# Altium schematic sheet Peripherals.SchDoc: Microcontroller Peripherals
size A3; DocumentNumber: 14; SheetNumber: 14; SheetTotal: 20
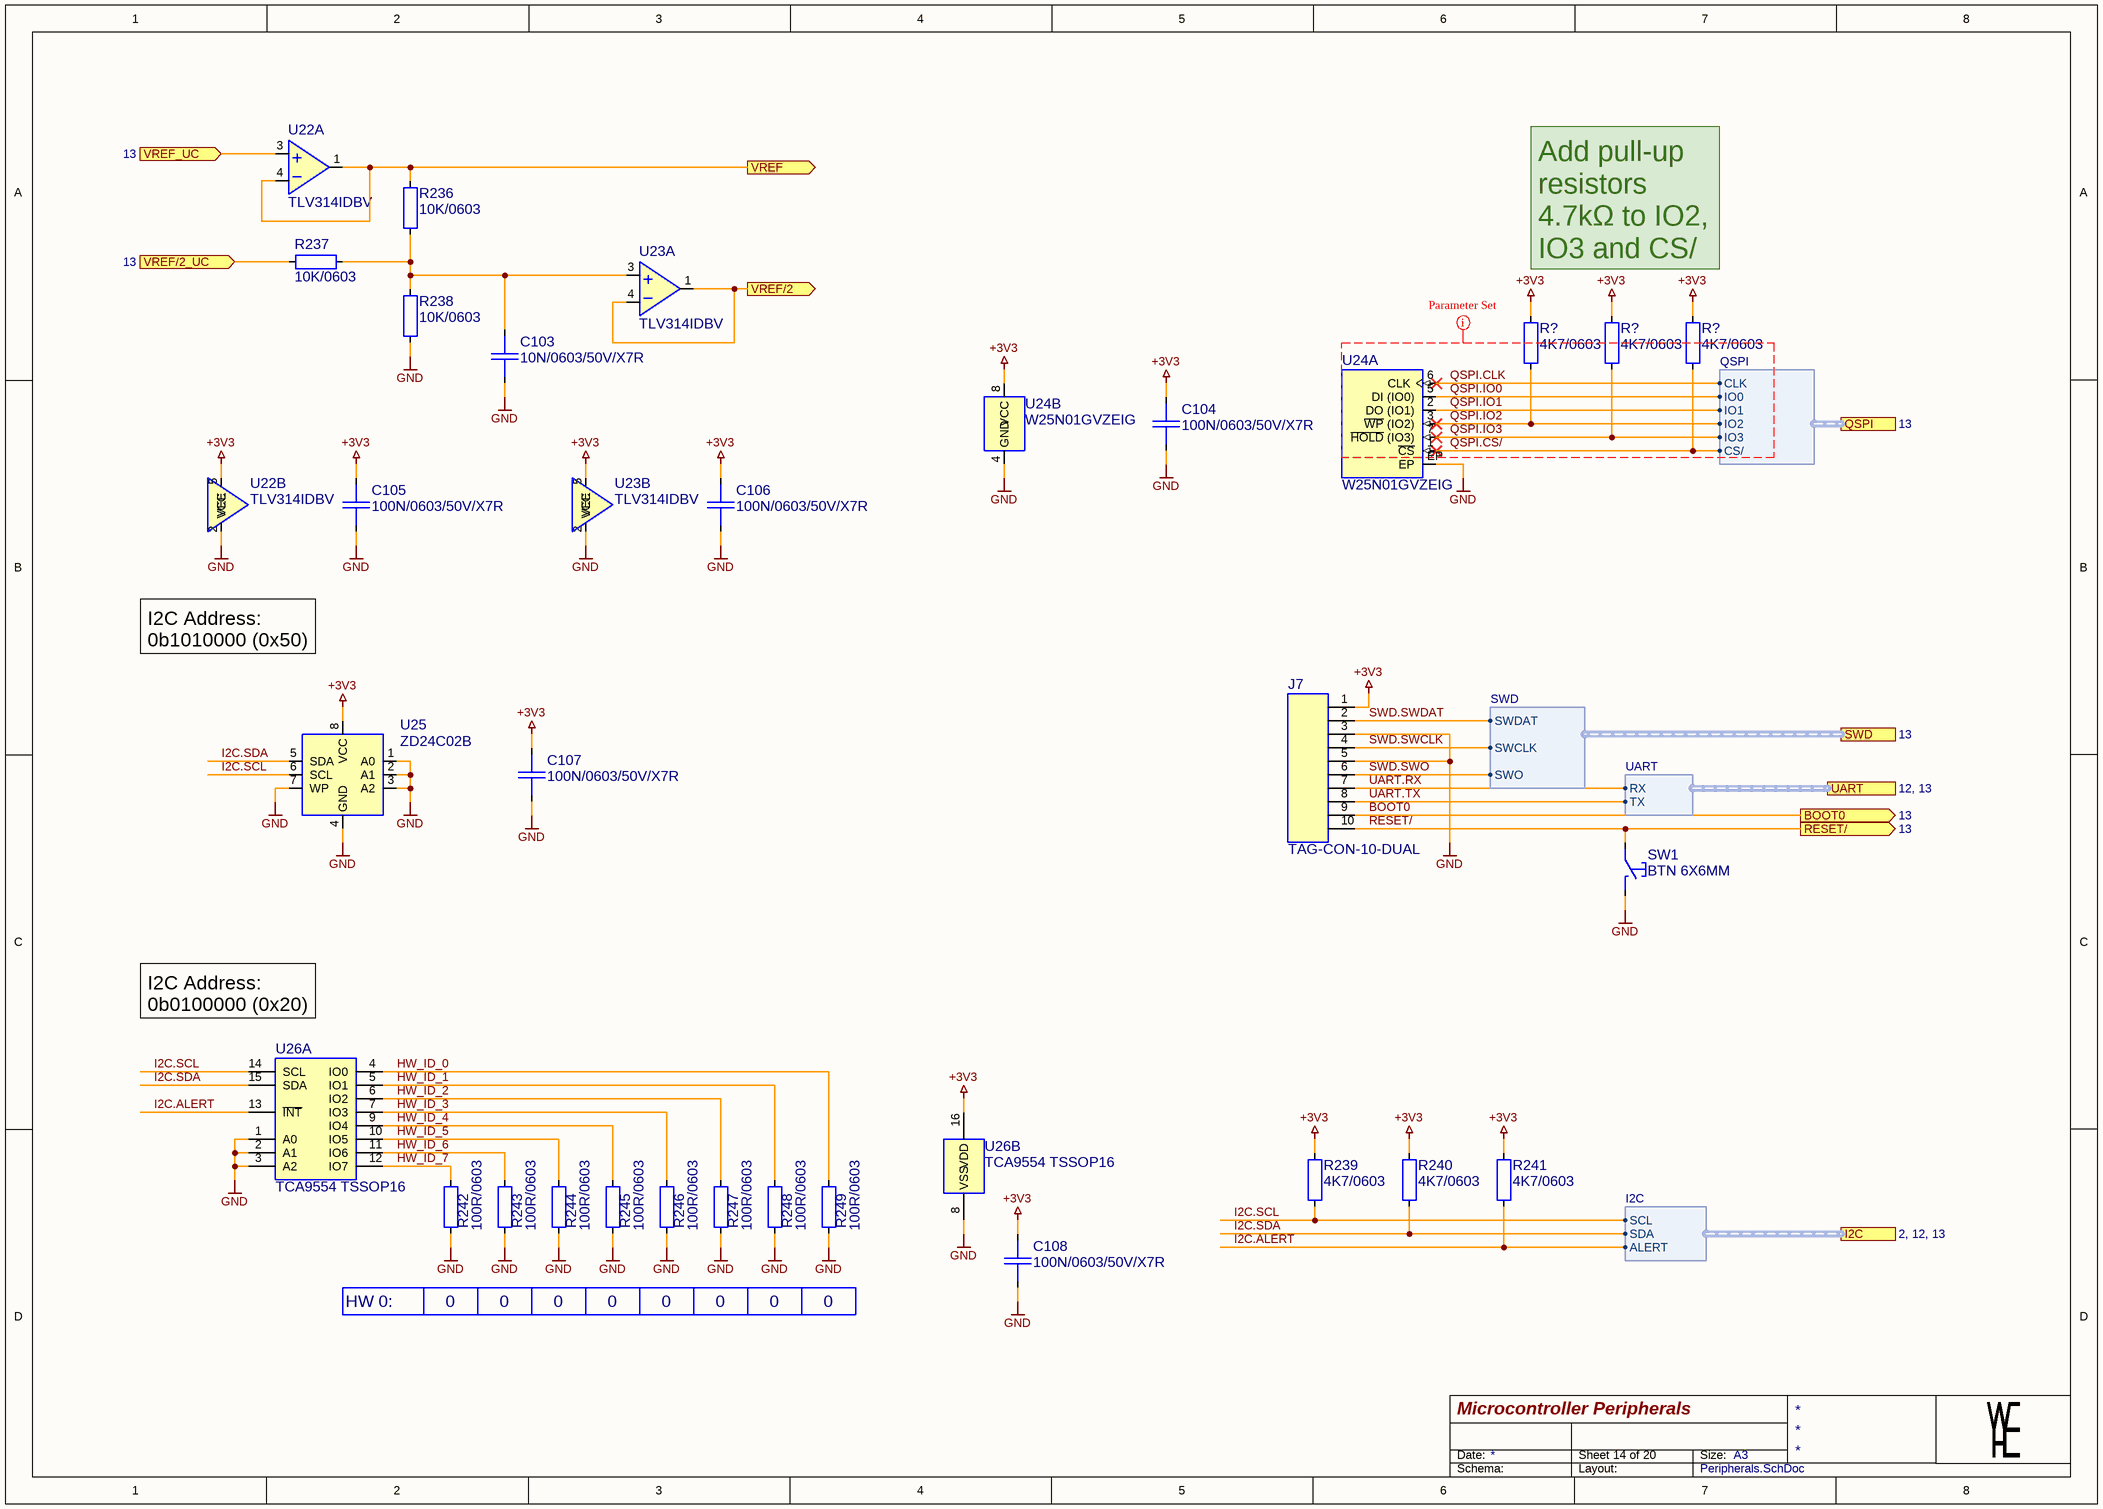
[diagram p0: Peripherals.SchDoc]

## Parts
(Parts that share a designator on the sheet are numbered #1, #2 ... from top to bottom, then left to right.)
C103  10N/0603/50V/X7R  [CAP0603_X7R]
C104  100N/0603/50V/X7R  [CAP0603_X7R]
C105  100N/0603/50V/X7R  [CAP0603_X7R]
C106  100N/0603/50V/X7R  [CAP0603_X7R]
C107  100N/0603/50V/X7R  [CAP0603_X7R]
C108  100N/0603/50V/X7R  [CAP0603_X7R]
J7  TAG-CON-10-DUAL  [TC2050-2]
R236  10K/0603  [R0603-0.40-WW]
R237  10K/0603  [R0603-0.40-WW]
R238  10K/0603  [R0603-0.40-WW]
R239  4K7/0603  [R0603-0.40-WW]
R240  4K7/0603  [R0603-0.40-WW]
R241  4K7/0603  [R0603-0.40-WW]
R242  100R/0603  [R0603-0.40-WW]
R243  100R/0603  [R0603-0.40-WW]
R244  100R/0603  [R0603-0.40-WW]
R245  100R/0603  [R0603-0.40-WW]
R246  100R/0603  [R0603-0.40-WW]
R247  100R/0603  [R0603-0.40-WW]
R248  100R/0603  [R0603-0.40-WW]
R249  100R/0603  [R0603-0.40-WW]
R?#1  4K7/0603  [R0603-0.40-WW]
R?#2  4K7/0603  [R0603-0.40-WW]
R?#3  4K7/0603  [R0603-0.40-WW]
SW1  BTN 6X6MM  [BTN-6X6MM-4.3MM-YELLOW]
U22  TLV314IDBV  [SOT2395P280X125-5-NW]  (parts A,B of 2)
U23  TLV314IDBV  [SOT2395P280X125-5-NW]  (parts A,B of 2)
U24  W25N01GVZEIG  [SON127P800X600X080-8-EP340X430]  (parts A,B of 2)
U25  ZD24C02B  [SOP127P600X155-8-SW]
U26  TCA9554 TSSOP16  [SOP065P640X110-16NW]  (parts A,B of 2)

## Ports
BOOT0 (out, see 13), I2C (harness I2C, see 2, 12, 13), QSPI (harness QSPI, see 13), RESET/ (out, see 13), SWD (harness SWD, see 13), UART (harness UART, see 12, 13), VREF (out), VREF/2 (out), VREF/2_UC (in, see 13), VREF_UC (in, see 13)

## Harnesses
I2C: ALERT, SCL, SDA
QSPI: CLK, IO0, CS/, IO1, IO2, IO3
UART: TX, RX
SWD: SWDAT, SWCLK, SWO

## Nets
+3V3: C104.1 C105.1 C106.1 C107.1 C108.1 J7.1 R239.1 R240.1 R241.1 R?#1.1 R?#2.1 R?#3.1 U22.5(VCC) U23.5(VCC) U24.8(VCC) U25.8(VCC) U26.16(VDD)
GND: C103.2 C104.2 C105.2 C106.2 C107.2 C108.2 J7.3 J7.5 R238.2 R242.2 R243.2 R244.2 R245.2 R246.2 R247.2 R248.2 R249.2 SW1.2(NO) U22.2(VEE) U23.2(VEE) U24.4(GND) U24.EP U25.1(A0) U25.2(A1) U25.3(A2) U25.4(GND) U25.7(WP) U26.1(A0) U26.2(A1) U26.3(A2) U26.8(VSS)
BOOT0: J7.9 ; port BOOT0
HW_ID_0: R249.1 U26.4(IO0)
HW_ID_1: R248.1 U26.5(IO1)
HW_ID_2: R247.1 U26.6(IO2)
HW_ID_3: R246.1 U26.7(IO3)
HW_ID_4: R245.1 U26.9(IO4)
HW_ID_5: R244.1 U26.10(IO5)
HW_ID_6: R243.1 U26.11(IO6)
HW_ID_7: R242.1 U26.12(IO7)
I2C.ALERT: R241.2 U26.13(~{INT}) ; port I2C.ALERT
I2C.SCL: R239.2 U25.6(SCL) U26.14(SCL) ; port I2C.SCL
I2C.SDA: R240.2 U25.5(SDA) U26.15(SDA) ; port I2C.SDA
QSPI.CLK: U24.6(CLK) ; port QSPI.CLK
QSPI.CS/: R?#3.2 U24.1(~{CS}) ; port QSPI.CS/
QSPI.IO0: U24.5(DI_(IO0)) ; port QSPI.IO0
QSPI.IO1: U24.2(DO_(IO1)) ; port QSPI.IO1
QSPI.IO2: R?#1.2 U24.3(~{WP}_(IO2)) ; port QSPI.IO2
QSPI.IO3: R?#2.2 U24.7(~{HOLD}_(IO3)) ; port QSPI.IO3
RESET/: J7.10 SW1.1(COM) ; port RESET/
SWD.SWCLK: J7.4 ; port SWD.SWCLK
SWD.SWDAT: J7.2 ; port SWD.SWDAT
SWD.SWO: J7.6 ; port SWD.SWO
UART.RX: J7.7 ; port UART.RX
UART.TX: J7.8 ; port UART.TX
VREF: R236.1 U22.1(OUT) U22.4(IN-) ; port VREF
VREF/2: U23.1(OUT) U23.4(IN-) ; port VREF/2
VREF/2_UC: R237.1 ; port VREF/2_UC
VREF_UC: U22.3(IN+) ; port VREF_UC
NetC103_1: C103.1 R236.2 R237.2 R238.1 U23.3(IN+)

## Layout directives
net class QSPI: QSPI.CLK, QSPI.CS/, QSPI.IO0, QSPI.IO1, QSPI.IO2, QSPI.IO3

## Notes on the sheet
- Add pull-up resistors 4.7kΩ to IO2, IO3 and CS/
- I2C Address:
  0b1010000 (0x50)
- I2C Address:
  0b0100000 (0x20)
- HW 0:
- 0
- Date:
- Size:
- A3
- Schema:
- Layout:

## Library data of the parts
C103 = 10N/0603/50V/X7R: CAP SM 0603 10nF 50V X7R; Manufacturer: GENERIC; Manufacturer 1: YAGEO; Manufacturer Part Number 1: CC0603KPX7R9BB103; Absolute Value: 1E-8; Eurocircuits GPN: GPC0603103; Part Number: 10N/0603/50V/X7R; Package: 0603; Value: 10nF; HelpURL: https://www.yageo.com/upload/media/product/app/datasheet/mlcc/upy-gphc_x7r_6_3v-to-250v.pdf; Supplier 1: Digi-Key; Supplier Part Number 1: 311-1572-1-ND; Manufacturer 2: YAGEO; Manufacturer Part Number 2: CC0603KRX7R9BB103; Supplier 2: Digi-Key; Supplier Part Number 2: 311-1085-1-ND; Manufacturer Part Number 3: CC0603KRX7R9BB103; Supplier 3: LCSC; Supplier Part Number 3: C100042
C104-C108 = 100N/0603/50V/X7R: CAP SM 0603 100nF 50V X7R; Manufacturer: GENERIC; Manufacturer 1: YAGEO; Manufacturer Part Number 1: CC0603KPX7R9BB104; Absolute Value: 1E-7; Eurocircuits GPN: GPC0603104; Part Number: 100N/0603/50V/X7R; Package: 0603; Value: 100nF; HelpURL: https://www.yageo.com/upload/media/product/app/datasheet/mlcc/upy-gphc_x7r_6_3v-to-250v.pdf; Supplier 1: Digi-Key; Supplier Part Number 1: 311-3567-1-ND; Supplier 3: LCSC; Supplier Part Number 3: C14663; Manufacturer 2: YAGEO; Manufacturer Part Number 2: CC0603MRX7R9BB104; Supplier 2: Digi-Key; Supplier Part Number 2: 311-4110-1-ND; JLC Type: Basic; Manufacturer Part Number 3: CC0603KRX7R9BB104
J7 = TAG-CON-10-DUAL: Tag-Connect 2050, 10 pins, two-sided; Part Number: TAG-CON-10-DUAL; Manufacturer: TAG-CONNECT; HelpURL: https://www.tag-connect.com/wp-content/uploads/bsk-pdf-manager/TC2050-IDC_Datasheet_7.pdf
R236-R238 = 10K/0603: RES SM 0603 10K; Manufacturer: GENERIC; Manufacturer 1: YAGEO; Manufacturer Part Number 1: RC0603FR-1310KL; Absolute Value: 10000; Eurocircuits GPN: GPR060310K; Part Number: 10K/0603; Package: 0603; Value: 10K; HelpURL: https://www.yageogroup.com/content/datasheet/asset/file/PYU-RC_GROUP_51_ROHS_L; Supplier 1: Digi-Key; Supplier Part Number 1: 13-RC0603FR-1310KLCT-ND; Manufacturer 2: YAGEO; Manufacturer Part Number 2: RC0603FR-1010KL; Supplier 2: Digi-Key; Supplier Part Number 2: 13-RC0603FR-1010KLCT-ND; Manufacturer 3: UNI-ROYAL(Uniroyal Elec); Manufacturer Part Number 3: 0603WAF1002T5E; Supplier 3: LCSC; Supplier Part Number 3: C25804; JLC Type: Basic
R239-R241 R?#1-R?#3 = 4K7/0603: RES SM 0603 4K7; Manufacturer: GENERIC; Manufacturer 1: YAGEO; Manufacturer Part Number 1: RC0603FR-134K7L; Absolute Value: 4700; Eurocircuits GPN: GPR06034K7; Part Number: 4K7/0603; Package: 0603; Value: 4K7; HelpURL: https://www.yageogroup.com/content/datasheet/asset/file/PYU-RC_GROUP_51_ROHS_L; Supplier 1: Digi-Key; Supplier Part Number 1: 13-RC0603FR-134K7LCT-ND; Manufacturer 2: YAGEO; Manufacturer Part Number 2: RC0603FR-104K7L; Supplier 2: Digi-Key; Supplier Part Number 2: 13-RC0603FR-104K7LCT-ND; Manufacturer 3: UNI-ROYAL(Uniroyal Elec); Manufacturer Part Number 3: 0603WAF4701T5E; Supplier 3: LCSC; Supplier Part Number 3: C23162; JLC Type: Basic
R242-R249 = 100R/0603: RES SM 0603 100R; Manufacturer: GENERIC; Manufacturer 1: YAGEO; Manufacturer Part Number 1: RC0603FR-13100RL; Absolute Value: 100; Eurocircuits GPN: GPR0603100R; Part Number: 100R/0603; Package: 0603; Value: 100R; HelpURL: https://www.yageogroup.com/content/datasheet/asset/file/PYU-RC_GROUP_51_ROHS_L; Supplier 1: Digi-Key; Supplier Part Number 1: 13-RC0603FR-13100RLCT-ND; Manufacturer 2: YAGEO; Manufacturer Part Number 2: RC0603FR-10100RL; Supplier 2: Digi-Key; Supplier Part Number 2: 13-RC0603FR-10100RLCT-ND; Manufacturer 3: UNI-ROYAL(Uniroyal Elec); Manufacturer Part Number 3: 0603WAF1000T5E; Supplier 3: LCSC; Supplier Part Number 3: C22775
SW1 = BTN 6X6MM 4.3MM 1.5N: Pushbutton switch, PCB mount, 6x6mm, 4.3mm height, 1.5N operating force; Manufacturer 1: Omron Electronics Inc-EMC Div; Manufacturer Part Number 1: B3F-1002; Part Number: BTN 6X6MM 4.3MM 1.5N; HelpURL: https://omronfs.omron.com/en_US/ecb/products/pdf/en-b3f.pdf; Supplier 1: Digi-Key; Supplier Part Number 1: SW401-ND
U22 U23 = TLV314 SOT23: TLV314, 3-MHz, Low-Power, Internal EMI Filter, RRIO, Operational Amplifier; Manufacturer: Texas Instruments; Manufacturer Part Number 1: TLV314IDBVR; Part Number: TLV314 SOT23; Package: SOT23-5; HelpURL: https://www.ti.com/lit/ds/symlink/tlv4314.pdf; Manufacturer 1: Texas Instruments; Supplier 1: Digi-Key; Supplier Part Number 1: 296-46275-1-ND; Manufacturer 3: Texas Instruments; Manufacturer Part Number 3: TLV314IDBVR; Supplier 3: LCSC; Supplier Part Number 3: C133032; Manufacturer 2: Texas Instruments; Manufacturer Part Number 2: TLV314IDBVT; Supplier 2: Digi-Key; Supplier Part Number 2: 296-44110-2-ND
U24 = W25N01GVZEIG: W25N01GVZEIG 3V 1G-BIT Serial SLC NAND Flash Memoryw with Dual/Quad SPI Buffer Read & Continuous Read; Manufacturer: Winbond; Manufacturer 1: Winbond Electronics; Manufacturer Part Number 1: W25N01GVZEIG TR; Part Number: W25N01GVZEIG; Package: DFN-8; HelpURL: https://www.winbond.com/resource-files/W25N01GV%20Rev%20O%20092619.pdf; Supplier 1: Digi-Key; Supplier Part Number 1: 256-W25N01GVZEIGTRCT-ND; Manufacturer 2: Winbond Electronics; Manufacturer Part Number 2: W25N01GVZEIG; Supplier 2: Digi-Key; Supplier Part Number 2: 256-W25N01GVZEIG-ND; Manufacturer 3: Winbond; Manufacturer Part Number 3: W25N01GVZEIG; Supplier 3: LCSC; Supplier Part Number 3: C907680; JLC Type: Extended
U25 = ZD24C02B: I2C-Compatible (2-wire) Serial EEPROM 2K bits; Manufacturer: Zetta; Part Number: ZD24C02B; Package: SOIC-8; HelpURL: https://datasheet.lcsc.com/lcsc/2402020955_Zetta-ZD24C02B-SSGMB_C5374786.pdf; Manufacturer 3: Zetta; Manufacturer Part Number 3: ZD24C02B-SSGMB; Supplier 3: LCSC; Supplier Part Number 3: C5374786; JLC Type: Extended
U26 = TCA9554 TSSOP16: TCA9554 Low Voltage 8-Bit I2C and SMBus Low-Power I/O Expander With Interrupt Output and Configuration Registers; Manufacturer: Texas Instruments; Manufacturer Part Number 1: TCA9554PWR; Part Number: TCA9554 TSSOP16; Package: TSSOP-16; HelpURL: https://www.ti.com/lit/ds/symlink/tca9554.pdf; Manufacturer 1: Texas Instruments; Supplier 1: Digi-Key; Supplier Part Number 1: 296-30135-1-ND; Manufacturer 3: TI; Manufacturer Part Number 3: TCA9554PWR; Supplier 3: LCSC; Supplier Part Number 3: C477924